# EAGLE design Apple DOS extension board smaller (EAGLE 7.6.0)
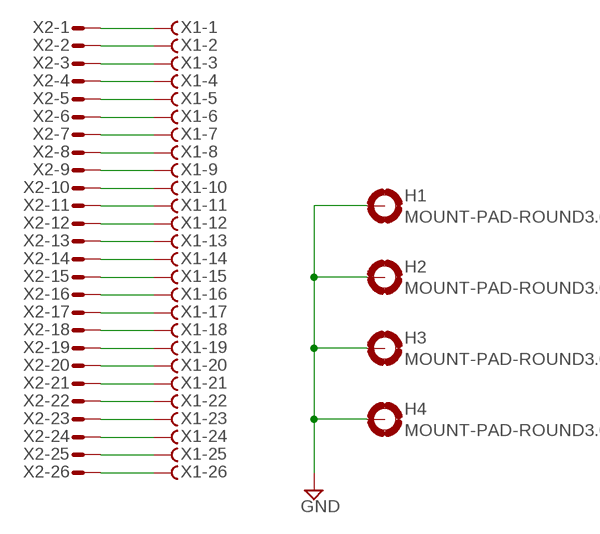
[diagram p0: schematic, sheet 1]

## Parts
H1  MOUNT-PAD-ROUND3.6  [3,6-PAD]
H2  MOUNT-PAD-ROUND3.6  [3,6-PAD]
H3  MOUNT-PAD-ROUND3.6  [3,6-PAD]
H4  MOUNT-PAD-ROUND3.6  [3,6-PAD]
X1  HF26HS  [HDF26H]
X2  HM26HS  [HDM26H]

## Nets
GND: H1.B3,6(MOUNT) H2.B3,6(MOUNT) H3.B3,6(MOUNT) H4.B3,6(MOUNT)
N$1: X1.1 X2.1
N$2: X1.2 X2.2
N$3: X1.3 X2.3
N$4: X1.4 X2.4
N$5: X1.5 X2.5
N$6: X1.6 X2.6
N$7: X1.7 X2.7
N$8: X1.8 X2.8
N$9: X1.9 X2.9
N$10: X1.10 X2.10
N$11: X1.11 X2.11
N$12: X1.12 X2.12
N$13: X1.13 X2.13
N$14: X1.14 X2.14
N$15: X1.15 X2.15
N$16: X1.16 X2.16
N$17: X1.17 X2.17
N$18: X1.18 X2.18
N$19: X1.19 X2.19
N$20: X1.20 X2.20
N$21: X1.21 X2.21
N$22: X1.22 X2.22
N$23: X1.23 X2.23
N$24: X1.24 X2.24
N$25: X1.25 X2.25
N$26: X1.26 X2.26

## Library data of the parts
H1-H4 = holes:MOUNT-PAD-ROUND: MOUNTING PAD, round
X1 = con-subd:HF26?S: SUB-D; OC_FARNELL: unknown; OC_NEWARK: unknown
X2 = con-subd:HM26?S: SUB-D; OC_FARNELL: unknown; OC_NEWARK: unknown

## Board
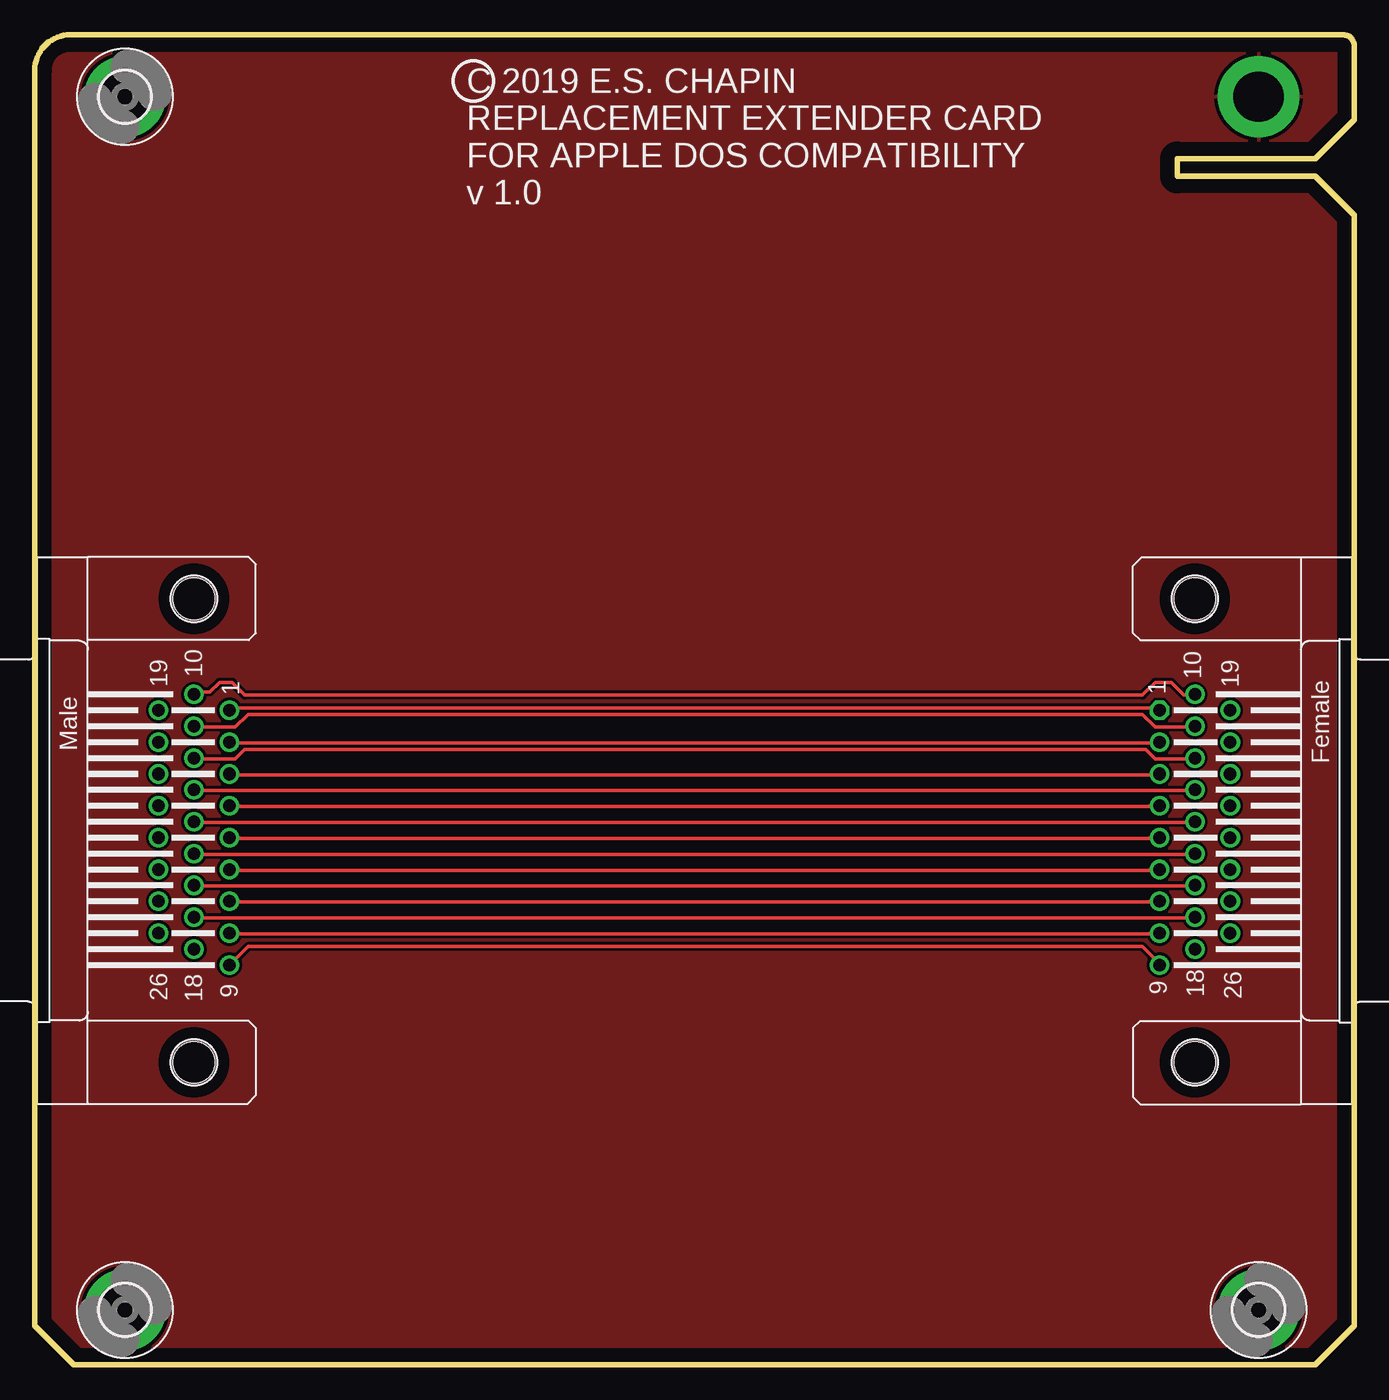
[diagram p1: board, top side]
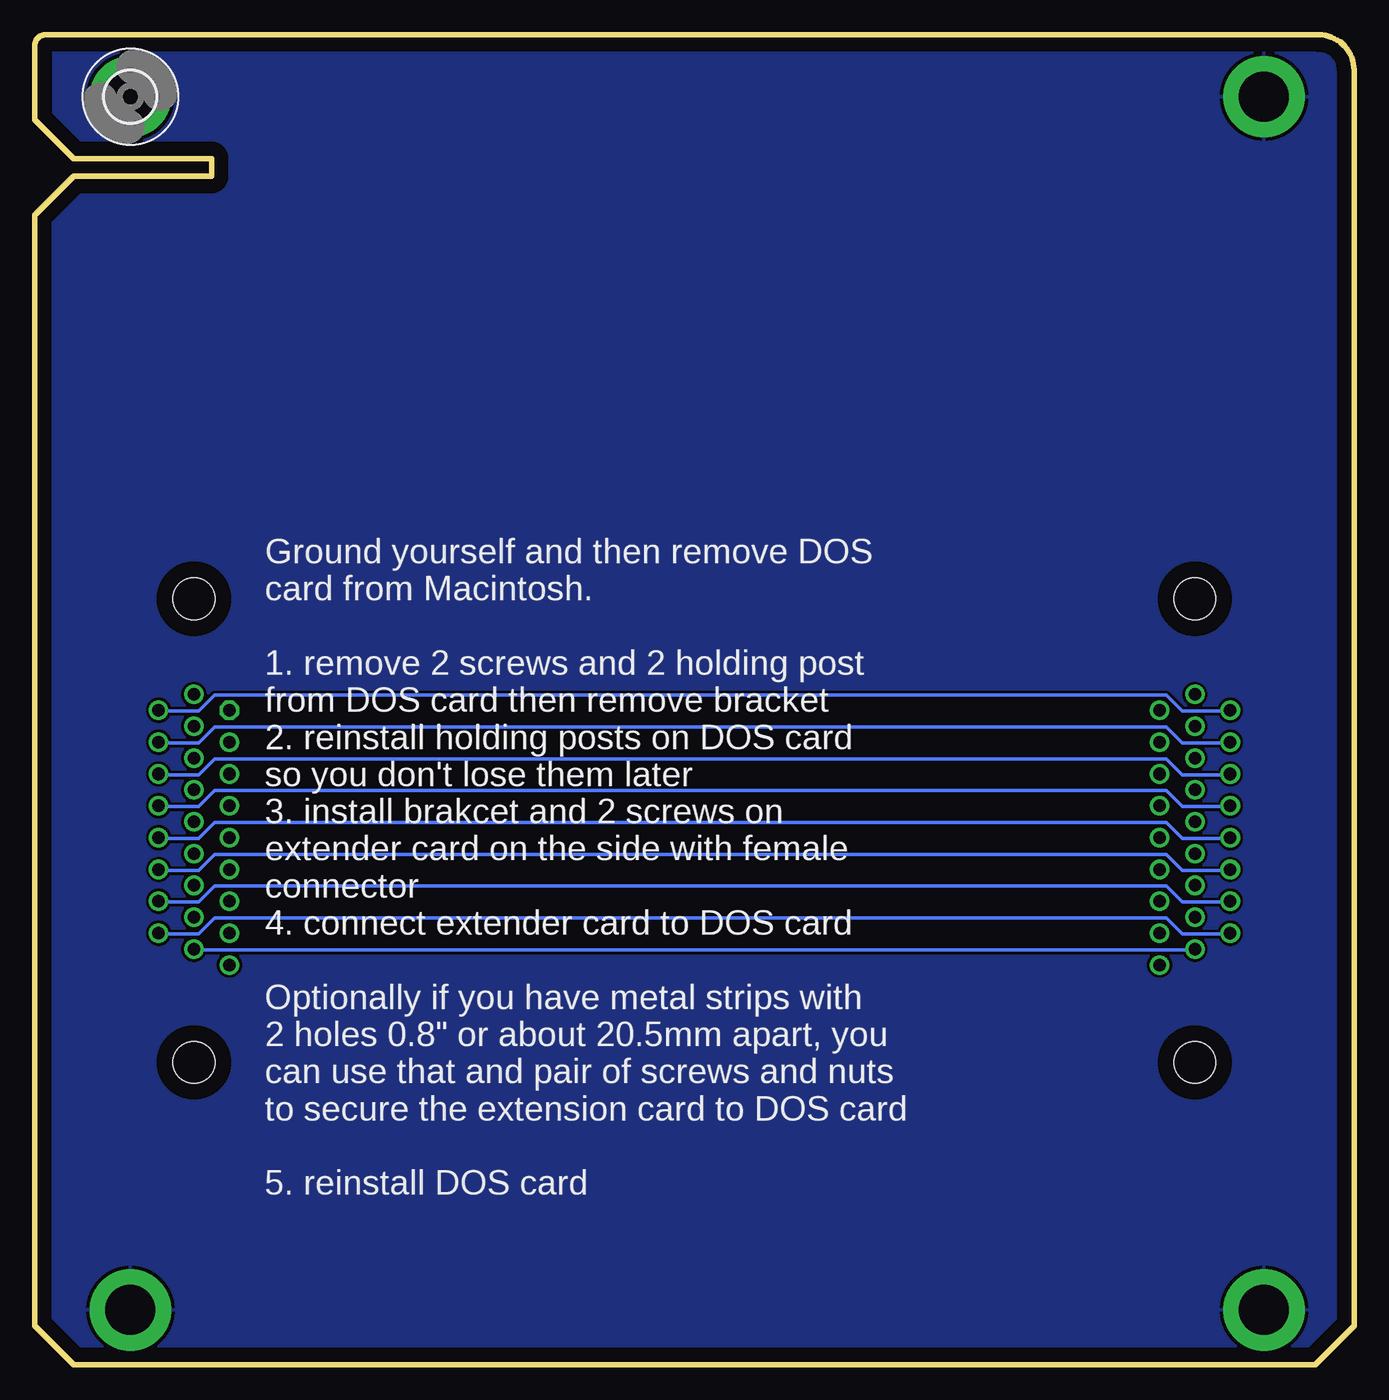
[diagram p2: board, bottom side, seen from below]

Size 94.74 x 95.5 mm. Coordinates in mm from the lower left corner, seen from the top.
Outline: 94.74,2.79 94.74,82.55 91.95,85.34 82.04,85.34 82.04,86.61 91.95,86.61 94.74,89.41 94.74,94.74 arc90 93.98,95.5 2.54,95.5 arc90 0,92.96 0,2.79 2.79,0 91.95,0 94.74,2.79
Copper layers (1*16): Top 0.035mm / dielectric 1.53mm / Bottom 0.035mm
Design rules "default *": minimum track width 10mil, minimum drill 24mil, track to track 8mil, track to pad 8mil, pad to pad 8mil, via to via 8mil, smd to smd 8mil, copper to edge 40mil, drill to drill 8mil, minimum pad ring 10mil, minimum via ring 8mil, stop-mask expansion 4mil, vias tented up to drill 0mil, thermal gap 10mil

### Footprints (pad centres in the part's own frame; a part is rotated, then mirrored left to right if it is on the bottom)
3,6-PAD = drill 3.6 pad 5.842: B3,6 0,0
HDF26H = drill 0.9 octagon: 1 8.639,2.54 | drill 0.9: 2 6.353,2.54; 3 4.067,2.54; 4 1.781,2.54; 5 -0.505,2.54; 6 -2.791,2.54; 7 -5.077,2.54; 8 -7.363,2.54; 9 -9.649,2.54; 10 9.782,0; 11 7.496,0; 12 5.21,0; 13 2.924,0; 14 0.638,0; 15 -1.648,0; 16 -3.934,0; 17 -6.22,0; 18 -8.506,0; 19 8.639,-2.54; 20 6.353,-2.54; 21 4.067,-2.54; 22 1.781,-2.54; 23 -0.505,-2.54; 24 -2.791,-2.54; 25 -5.077,-2.54; 26 -7.363,-2.54 | hole 3: -16.65,0; 16.65,0
HDM26H = drill 0.9: 1 -8.639,2.54; 2 -6.353,2.54; 3 -4.067,2.54; 4 -1.781,2.54; 5 0.505,2.54; 6 2.791,2.54; 7 5.077,2.54; 8 7.363,2.54; 9 9.649,2.54; 10 -9.782,0; 11 -7.496,0; 12 -5.21,0; 13 -2.924,0; 14 -0.638,0; 15 1.648,0; 16 3.934,0; 17 6.22,0; 18 8.506,0; 19 -8.639,-2.54; 20 -6.353,-2.54; 21 -4.067,-2.54; 22 -1.781,-2.54; 23 0.505,-2.54; 24 2.791,-2.54; 25 5.077,-2.54; 26 7.363,-2.54 | hole 3: -16.65,0; 16.65,0

### Placement (x,y rotation side)
H1  6.48,3.94 0 top
H2  87.88,3.94 0 top
H3  6.48,91.06 0 top
H4  87.88,91.06 0 bottom
X1  83.31,38.35 90 top
X2  11.43,38.35 270 top

### Tracks (layer width: path | path; a pad name or v marks a point on that pad's centre or on a via)
GND
  pour Top: -2.79,98.04 96.77,98.04 96.77,-8.38 -2.79,-8.38 -2.79,97.54
  pour Bottom: -2.54,97.79 96.77,97.79 96.77,-8.38 -2.79,-8.38 -2.79,97.54
N$1
  Top 0.254: X2.1 14.17,47.17 80.7,47.17 X1.1
N$2
  Top 0.254: X2.2 14.17,44.65 80.7,44.65 X1.2
N$3
  Top 0.254: X2.3 14.17,42.37 80.7,42.37 X1.3
N$4
  Top 0.254: X2.4 14.17,40.08 80.7,40.08 X1.4
N$5
  Top 0.254: X2.5 14.17,37.8 80.7,37.8 X1.5
N$6
  Top 0.254: X2.6 14.17,35.51 80.7,35.51 X1.6
N$7
  Top 0.254: X2.7 14.17,33.22 80.7,33.22 X1.7
N$8
  Top 0.254: X2.8 14.17,30.94 80.7,30.94 X1.8
N$9
  Top 0.254: X2.9 14.17,28.88 15.32,30.02 79.55,30.02 80.7,28.88 X1.9
N$10
  Top 0.254: X2.10 11.43,48.31 12.57,48.31 13.26,49 14.17,49 15.09,48.08 79.55,48.08 80.47,49 81.61,49 82.53,48.08 83.21,48.08 X1.10
N$11
  Top 0.254: X2.11 11.43,45.8 14.4,45.8 15.32,46.71 79.55,46.71 80.47,45.8 83.21,45.8 X1.11
N$12
  Top 0.254: X2.12 11.43,43.51 14.4,43.51 15.09,44.2 79.78,44.2 80.47,43.51 83.21,43.51 X1.12
N$13
  Top 0.254: X2.13 11.43,41.22 83.21,41.22 X1.13
N$14
  Top 0.254: X2.14 11.43,38.94 83.21,38.94 X1.14
N$15
  Top 0.254: X2.15 11.43,36.65 83.21,36.65 X1.15
N$16
  Top 0.254: X2.16 11.43,34.37 83.21,34.37 X1.16
N$17
  Top 0.254: X2.17 11.43,32.08 83.21,32.08 X1.17
N$18
  Bottom 0.254: X2.18 11.43,29.79 83.21,29.79 X1.18
N$19
  Bottom 0.254: X2.19 8.91,46.94 12.34,46.94 13.49,48.08 81.84,48.08 82.98,46.94 85.72,46.94 X1.19
N$20
  Bottom 0.254: X2.20 8.91,44.65 12.34,44.65 13.49,45.8 81.84,45.8 82.98,44.65 85.72,44.65 X1.20
N$21
  Bottom 0.254: X2.21 8.91,42.37 12.34,42.37 13.49,43.51 81.84,43.51 82.98,42.37 85.72,42.37 X1.21
N$22
  Bottom 0.254: X2.22 8.91,40.08 12.34,40.08 13.49,41.22 81.84,41.22 82.98,40.08 85.72,40.08 X1.22
N$23
  Bottom 0.254: X2.23 8.91,37.8 12.34,37.8 13.49,38.94 81.84,38.94 82.98,37.8 85.72,37.8 X1.23
N$24
  Bottom 0.254: X2.24 8.91,35.51 12.34,35.51 13.49,36.65 81.84,36.65 82.98,35.51 85.72,35.51 X1.24
N$25
  Bottom 0.254: X2.25 8.91,33.22 12.34,33.22 13.49,34.37 81.84,34.37 82.98,33.22 85.72,33.22 X1.25
N$26
  Bottom 0.254: X2.26 8.91,30.94 12.34,30.94 13.49,32.08 81.84,32.08 82.98,30.94 85.72,30.94 X1.26

### Text on the board
tNames: C 2019 E.S. CHAPIN / REPLACEMENT EXTENDER CARD / FOR APPLE DOS COMPATIBILITY / v 1.0 | 96mm by 95 mm
bNames: Ground yourself and then remove DOS / card from Macintosh. / / 1. remove 2 screws and 2 holding post / from DOS card then remove bracket / 2. reinstall holding posts on DOS card / so you don't lose them later / 3. install brakcet and 2 screws on / extender card on the side with female / connector / 4. connect extender card to DOS card / / Optionally if you have metal strips with / 2 holes 0.8" or about 20.5mm apart, you / can use that and pair of screws and nuts / to secure the extension card to DOS card / / 5. reinstall DOS card